# Altium schematic sheet LEDs.SchDoc
size A4; SheetNumber: 2; SheetTotal: 2
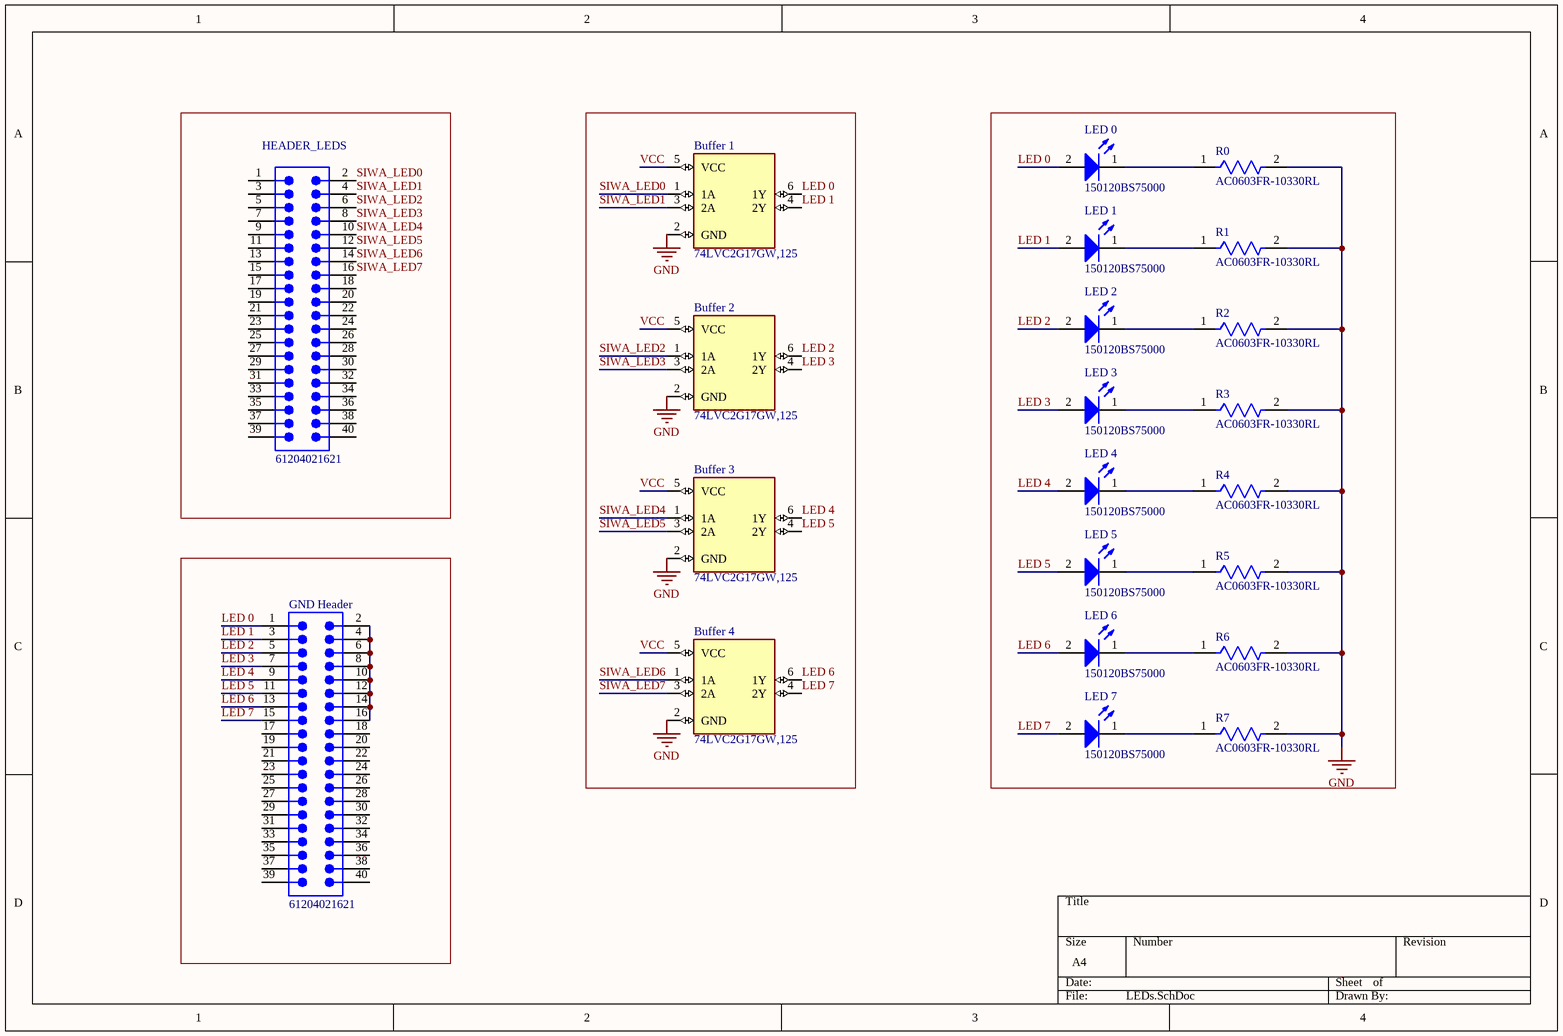
[diagram p0: LEDs.SchDoc]

## Parts
Buffer_1  74LVC2G17GW,125  [SOT363_INFINEON]
Buffer_2  74LVC2G17GW,125  [SOT363_INFINEON]
Buffer_3  74LVC2G17GW,125  [SOT363_INFINEON]
Buffer_4  74LVC2G17GW,125  [SOT363_INFINEON]
GND_Header  61204021621  [61204021621]
HEADER_LEDS  61204021621  [61204021621]
LED_0  150120BS75000  [WL-SMCW_1206_150120xx75000]
LED_1  150120BS75000  [WL-SMCW_1206_150120xx75000]
LED_2  150120BS75000  [WL-SMCW_1206_150120xx75000]
LED_3  150120BS75000  [WL-SMCW_1206_150120xx75000]
LED_4  150120BS75000  [WL-SMCW_1206_150120xx75000]
LED_5  150120BS75000  [WL-SMCW_1206_150120xx75000]
LED_6  150120BS75000  [WL-SMCW_1206_150120xx75000]
LED_7  150120BS75000  [WL-SMCW_1206_150120xx75000]
R0  AC0603FR-10330RL  [FP-AC0603-IPC_A]
R1  AC0603FR-10330RL  [FP-AC0603-IPC_A]
R2  AC0603FR-10330RL  [FP-AC0603-IPC_A]
R3  AC0603FR-10330RL  [FP-AC0603-IPC_A]
R4  AC0603FR-10330RL  [FP-AC0603-IPC_A]
R5  AC0603FR-10330RL  [FP-AC0603-IPC_A]
R6  AC0603FR-10330RL  [FP-AC0603-IPC_A]
R7  AC0603FR-10330RL  [FP-AC0603-IPC_A]

## Nets
GND: Buffer_1.2(GND) Buffer_2.2(GND) Buffer_3.2(GND) Buffer_4.2(GND) R0.2 R1.2 R2.2 R3.2 R4.2 R5.2 R6.2 R7.2
LED 0: Buffer_1.6(1Y) GND_Header.1 LED_0.2(A)
LED 1: Buffer_1.4(2Y) GND_Header.3 LED_1.2(A)
LED 2: Buffer_2.6(1Y) GND_Header.5 LED_2.2(A)
LED 3: Buffer_2.4(2Y) GND_Header.7 LED_3.2(A)
LED 4: Buffer_3.6(1Y) GND_Header.9 LED_4.2(A)
LED 5: Buffer_3.4(2Y) GND_Header.11 LED_5.2(A)
LED 6: Buffer_4.6(1Y) GND_Header.13 LED_6.2(A)
LED 7: Buffer_4.4(2Y) GND_Header.15 LED_7.2(A)
SIWA_LED0: Buffer_1.1(1A) HEADER_LEDS.2
SIWA_LED1: Buffer_1.3(2A) HEADER_LEDS.4
SIWA_LED2: Buffer_2.1(1A) HEADER_LEDS.6
SIWA_LED3: Buffer_2.3(2A) HEADER_LEDS.8
SIWA_LED4: Buffer_3.1(1A) HEADER_LEDS.10
SIWA_LED5: Buffer_3.3(2A) HEADER_LEDS.12
SIWA_LED6: Buffer_4.1(1A) HEADER_LEDS.14
SIWA_LED7: Buffer_4.3(2A) HEADER_LEDS.16
VCC: Buffer_1.5(VCC) Buffer_2.5(VCC) Buffer_3.5(VCC) Buffer_4.5(VCC)
NetGND_Header_2: GND_Header.2 GND_Header.4 GND_Header.6 GND_Header.8 GND_Header.10 GND_Header.12 GND_Header.14 GND_Header.16
NetLED_0_1: LED_0.1(K) R0.1
NetLED_1_1: LED_1.1(K) R1.1
NetLED_2_1: LED_2.1(K) R2.1
NetLED_3_1: LED_3.1(K) R3.1
NetLED_4_1: LED_4.1(K) R4.1
NetLED_5_1: LED_5.1(K) R5.1
NetLED_6_1: LED_6.1(K) R6.1
NetLED_7_1: LED_7.1(K) R7.1

Not connected (* = marked no-connect by the designer): GND_Header 17 18 19 20 21 22 23 24 25 26 27 28 29 30 31 32 33 34 35 36 37 38 39 40; HEADER_LEDS 1 3 5 7 9 11 13 15 17 18 19 20 21 22 23 24 25 26 27 28 29 30 31 32 33 34 35 36 37 38 39 40

## Library data of the parts
Buffer_1-Buffer_4 = 74LVC2G17GW,125: Buffer, Non-Inverting 2 Element 1 Bit per Element Push-Pull Output 6-TSSOP; MF: Nexperia USA; SnapEDA_Link: https://www.snapeda.com/parts/74LVC2G17GW,125/Nexperia/view-part/?ref=snap; Package: TSSOP6-6 Nexperia USA Inc.; Value: *; MP: 74LVC2G17GW,125; Check_prices: https://www.snapeda.com/parts/74LVC2G17GW,125/Nexperia/view-part/?ref=eda
GND_Header HEADER_LEDS = CMP-1502-00015-4: WR-BHD Straight Male, Box Header, Through Hole, 2 Rows, 40 Contacts, 2.54mm Pitch; Number of Positions: 40; Contact Resistance: 20mΩ; Current Rating: 3A; Connector Type: Male Pin; Operating Supply Voltage: 250V; Insulation Resistance: 1GΩ; Color: Black; Row Spacing: 2.54mm; Pitch: 2.54mm; RoHS: Compliant; Max Operating Temperature: 105°C; Insulation Material: PBT; Number of Pins: 40; Contact Plating: Gold; Orientation: Vertical; Voltage Rating: 250V; Number of Rows: 2; Lead Pitch: 2.54mm; Length: 58.46mm; Mount: Through Hole; Gender: Male; Number of Contacts: 40; Height: 9.25mm; Min Operating Temperature: -40°C; Contact Material: Gold; Termination: Solder; REACH SVHC: Unknown
LED_0-LED_7 = CMP-1426-00015-3: WL-SMCW SMT Mono-Color Chip LED Waterclear; Manufacturer Package Identifier: LED_1206; Dominant Wavelength: 470nm; Lens Style: Clear, Rectangular; Test Current: 20mA; Forward Voltage: 3.2V; Forward Current: 100mA; Peak Wavelength: 465nm; Max Reverse Voltage (DC): 5V; Viewing Angle: 140°; Luminous Intensity: 145mcd; Max Operating Temperature: 85°C; Case Code (Imperial): 1206; Length: 3.2mm; Width: 1.6mm; Min Operating Temperature: -40°C; Height: 680µm; Case Code (Metric): 3216; Packaging: Tape and Reel; RoHS: Compliant; Case/Package: 1206; REACH SVHC: Unknown; Wavelength: 470nm; Mount: Surface Mount; Color: Blue
R0-R7 = CMP-03412-032342-2: RES 330Ω 1.00% 0.1W 0603; RoHS Compliant: Yes